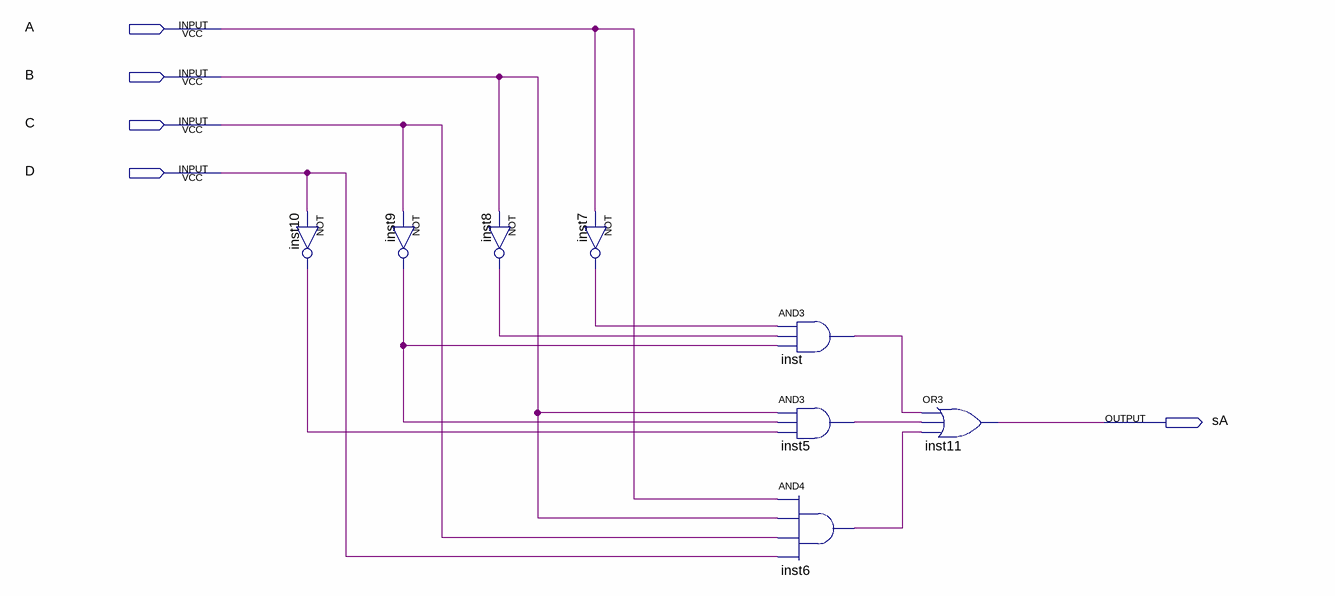
[diagram p0: schematic sheet]
// Quartus schematic decodificadorParcelaSaidaA.bdf as structural Verilog: 8 symbols, 5 pins
module decodificadorParcelaSaidaA (
  input  A,
  input  B,
  input  C,
  input  D,
  output sA
);

  wire inst5_out, inst6_out, inst7_out, inst8_out, inst9_out, inst10_out, inst_out;

  not inst10 (inst10_out, D);
  not inst9 (inst9_out, C);
  not inst8 (inst8_out, B);
  not inst7 (inst7_out, A);
  and inst (inst_out, inst7_out, inst8_out, inst9_out);
  and inst5 (inst5_out, B, inst9_out, inst10_out);
  and inst6 (inst6_out, A, B, C, D);
  or inst11 (sA, inst_out, inst5_out, inst6_out);
endmodule
